# Altium schematic sheet iSystem-arduino_connector.SchDoc
size A4; SheetNumber: 4; SheetTotal: 8
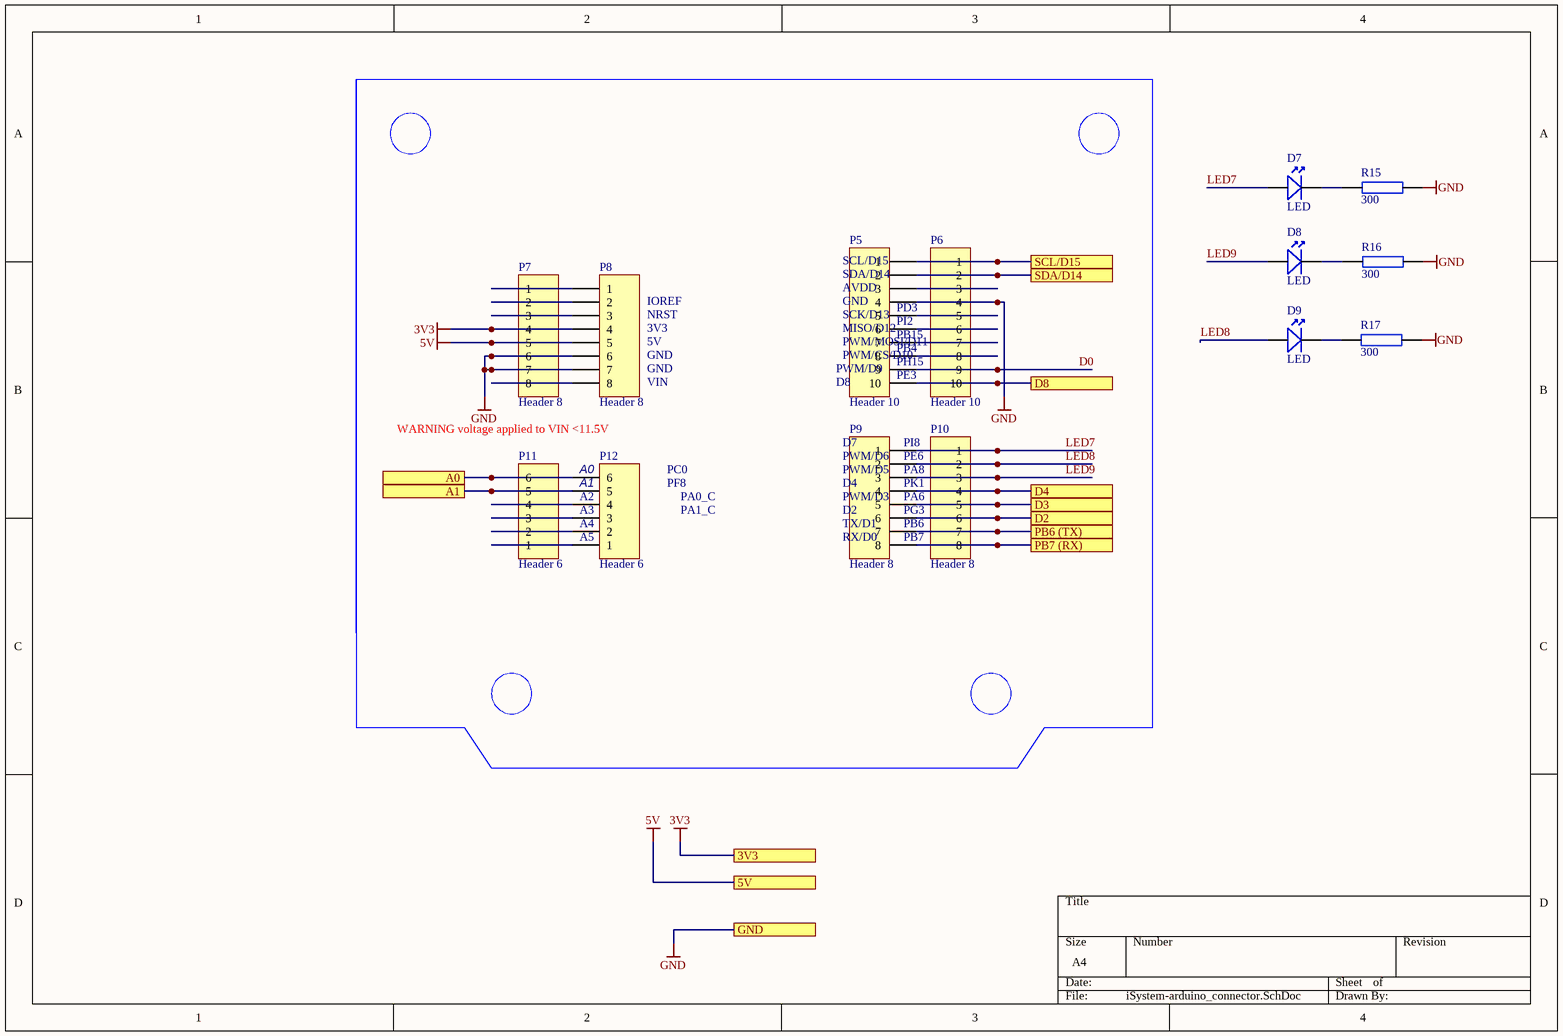
[diagram p0: iSystem-arduino_connector.SchDoc]

## Parts
D7  LED  [0805 LED RED]
D8  LED  [0805 LED RED]
D9  LED  [0805 LED RED]
P5  Header 10  [HDR1X10]
P6  Header 10  [HDR1X10]
P7  Header 8  [HDR1X8]
P8  Header 8  [HDR1X8]
P9  Header 8  [HDR1X8]
P10  Header 8  [HDR1X8]
P11  Header 6  [HDR1X6]
P12  Header 6  [HDR1X6]
R15  300  [0603]
R16  300  [0603]
R17  300  [0603]

## Ports
3V3, 5V, A0, A1, D2, D3, D4, D8, GND, PB6 (TX), PB7 (RX), SCL/D15, SDA/D14

## Nets
3V3: P7.4 P8.4 ; port 3V3
5V: P7.5 P8.5 ; port 5V
GND: P5.4 P6.4 P7.6 P7.7 P8.6 P8.7 R15.1 R16.1 R17.1 ; port GND
A0: P11.6 P12.6 ; port A0
A1: P11.5 P12.5 ; port A1
D0: P5.9 P6.9
D2: P9.6 P10.6 ; port D2
D3: P9.5 P10.5 ; port D3
D4: P9.4 P10.4 ; port D4
D8: P5.10 P6.10 ; port D8
LED7: D7.1(A) P9.1 P10.1
LED8: D9.1(A) P9.2 P10.2
LED9: D8.1(A) P9.3 P10.3
PB6 (TX): P9.7 P10.7 ; port PB6 (TX)
PB7 (RX): P9.8 P10.8 ; port PB7 (RX)
SCL/D15: P5.1 P6.1 ; port SCL/D15
SDA/D14: P5.2 P6.2 ; port SDA/D14
NetD7_2: D7.2(K) R15.2
NetD8_2: D8.2(K) R16.2
NetD9_2: D9.2(K) R17.2
NetP5_3: P5.3 P6.3
NetP5_5: P5.5 P6.5
NetP5_6: P5.6 P6.6
NetP5_7: P5.7 P6.7
NetP5_8: P5.8 P6.8
NetP7_1: P7.1 P8.1
NetP7_2: P7.2 P8.2
NetP7_3: P7.3 P8.3
NetP7_8: P7.8 P8.8
NetP11_1: P11.1 P12.1
NetP11_2: P11.2 P12.2
NetP11_3: P11.3 P12.3
NetP11_4: P11.4 P12.4

## Notes on the sheet
- (near P8) IOREF
- (near P5) SDA/D14
- (near P5) SCL/D15
- (near P5) AVDD
- (near P5) GND
- (near P5) PD3
- (near P8) NRST
- (near P8) 3V3
- (near P8) 5V
- (near P8) GND
- (near P8) VIN
- D8
- PWM/D9
- (near P5) PWM/CS/D10
- (near P5) SCK/D13
- (near P5) MISO/D12
- (near P5) PWM/MOSI/D11
- (near P5) PE3
- (near P5) PB4
- (near P5) PH15
- (near P5) PB15
- (near P5) PI2
- WARNING voltage applied to VIN <11.5V
- D7
- (near P9) PI8
- (near P12) A0
- (near P12) A1
- (near P12) A2
- (near P12) A3
- (near P12) PC0
- (near P12) PF8
- (near P12) PA0_C
- (near P12) PA1_C
- (near P9) D2
- (near P9) D4
- (near P9) PWM/D3
- (near P9) PWM/D5
- (near P9) PWM/D6
- (near P9) PG3
- (near P9) PK1
- (near P9) PA8
- (near P9) PE6
- (near P9) PA6
- (near P12) A4
- (near P12) A5
- (near P9) RX/D0
- (near P9) TX/D1
- (near P9) PB6
- (near P9) PB7

## Library data of the parts
P5 P6 = Header 10: Header, 10-Pin; LatestRevisionDate: 17-Jul-2002; LatestRevisionNote: Re-released for DXP Platform.; Publisher: Altium Limited
P7-P10 = Header 8: Header, 8-Pin; LatestRevisionDate: 17-Jul-2002; LatestRevisionNote: Re-released for DXP Platform.; Publisher: Altium Limited
P11 P12 = Header 6: Header, 6-Pin; LatestRevisionDate: 17-Jul-2002; LatestRevisionNote: Re-released for DXP Platform.; Publisher: Altium Limited
R15-R17 = Resistor: Value: ?